# Altium schematic sheet 5_GPIOBanks.SchDoc: GPIO Banks (13-16)
size Legal; Date: 12/27/2025; Author: Praveen Perera; DrawnBy: Praveen Perera; Engineer: Praveen Perera; Revision: 0; SheetNumber: 5; SheetTotal: 9
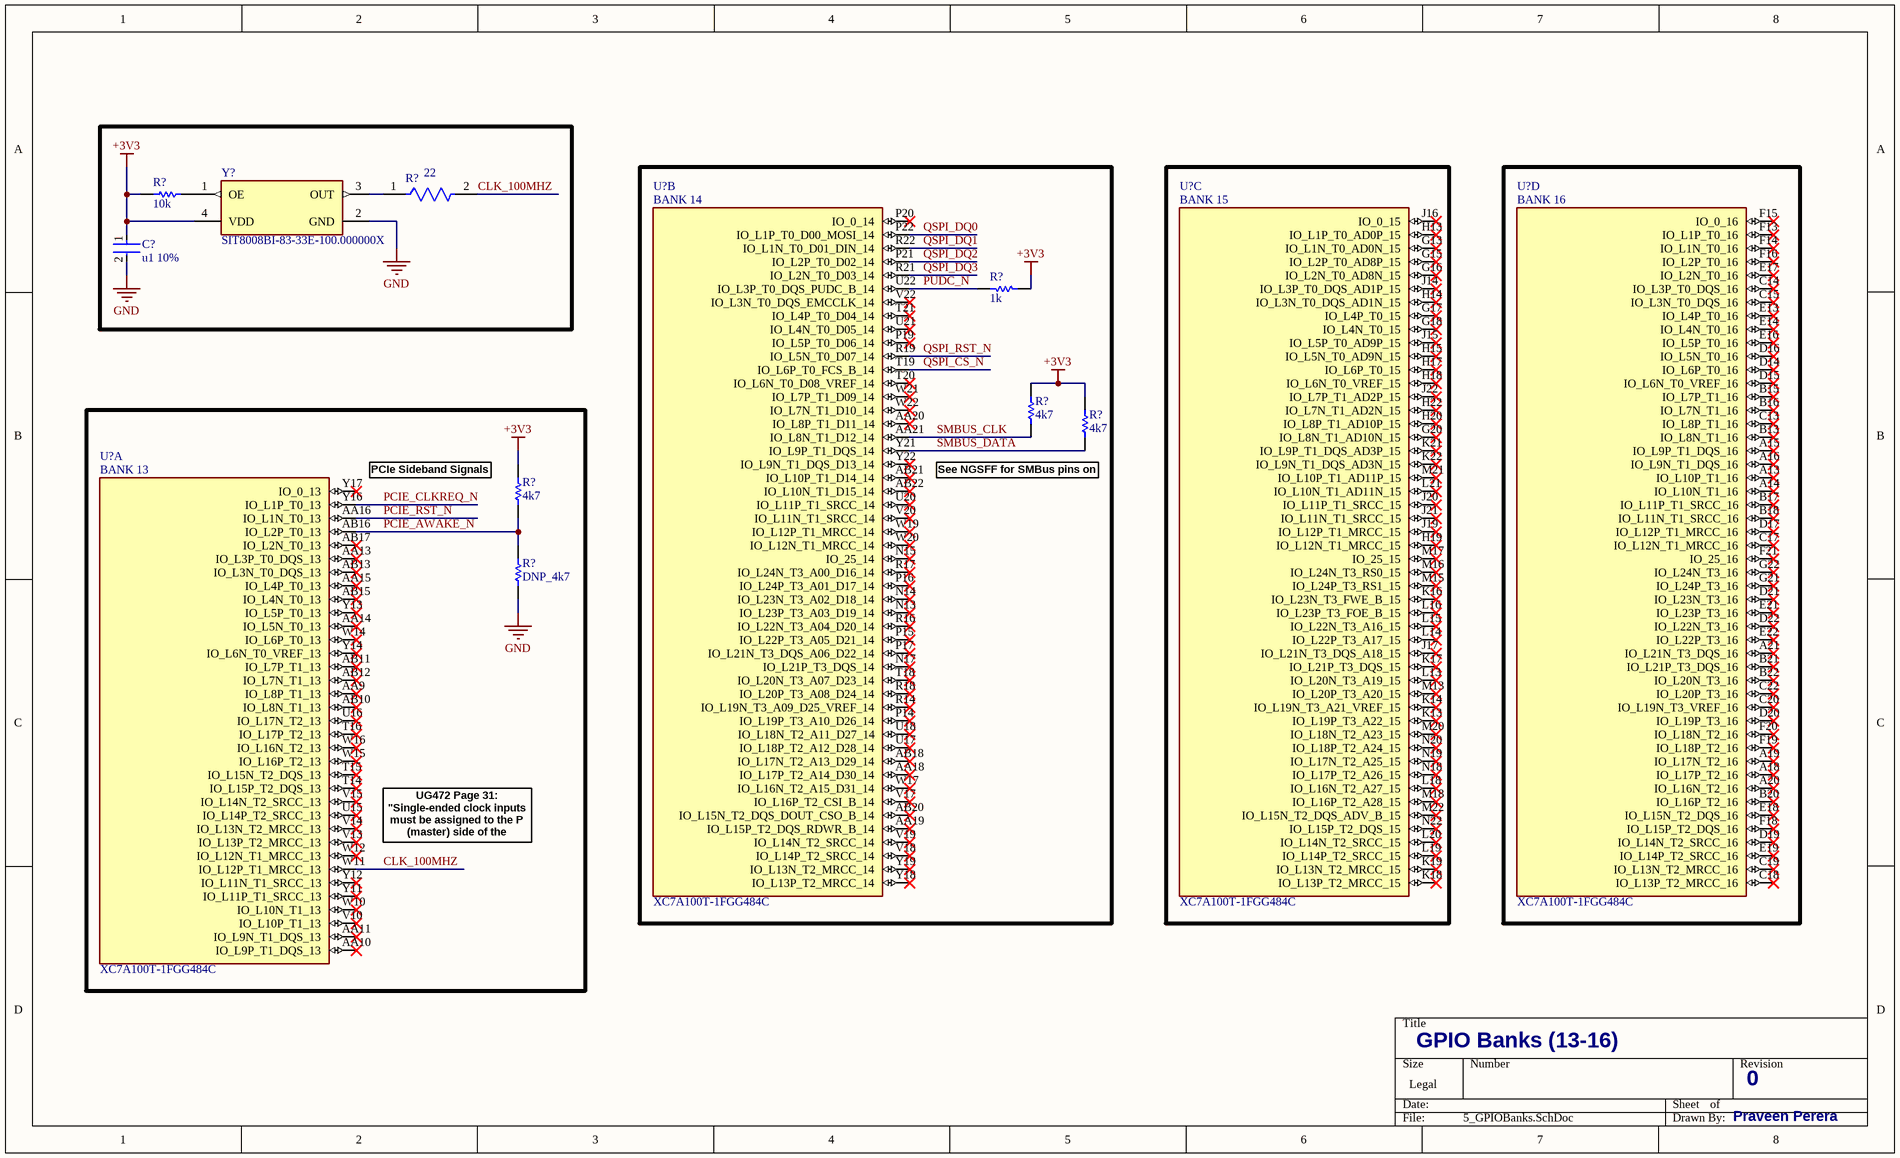
[diagram p0: 5_GPIOBanks.SchDoc]

## Parts
(Parts that share a designator on the sheet are numbered #1, #2 ... from top to bottom, then left to right.)
C?  u1 10%  [FP-CL891-IPC_C]
R?#1  10k  [RESC1005X40X25LL10T10]
R?#2  22  [FP-RMCF0201-IPC_C]
R?#3  1k  [RESC0603X28X15ML05T05]
R?#4  4k7  [RESC0603X28X15NL05T05]
R?#5  4k7  [RESC0603X28X15NL05T05]
R?#6  4k7  [RESC0603X28X15NL05T05]
R?#7  DNP_4k7  [RESC0603X28X15NL05T05]
U?#1  XC7A100T-1FGG484C  [BGA484C100P22X22_2300X2300X260N]  (part B of 14)
U?#2  XC7A100T-1FGG484C  [BGA484C100P22X22_2300X2300X260N]  (part C of 14)
U?#3  XC7A100T-1FGG484C  [BGA484C100P22X22_2300X2300X260N]  (part D of 14)
U?#4  XC7A100T-1FGG484C  [BGA484C100P22X22_2300X2300X260N]  (part A of 14)
Y?  SIT8008BI-83-33E-100.000000X  [FP-SiT8008-8-MFG]

## Nets
+3V3: C?.1 R?#1.1 R?#3.1 R?#4.2 R?#5.2 R?#6.2 Y?.4(VDD)
GND: C?.2 R?#7.1 Y?.2(GND)
CLK_100MHZ: R?#2.2 U?#4.W11(IO_L12P_T1_MRCC_13)
PCIE_AWAKE_N: R?#6.1 R?#7.2 U?#4.AB16(IO_L2P_T0_13)
PCIE_CLKREQ_N: U?#4.Y16(IO_L1P_T0_13)
PCIE_RST_N: U?#4.AA16(IO_L1N_T0_13)
PUDC_N: R?#3.2 U?#1.U22(IO_L3P_T0_DQS_PUDC_B_14)
QSPI_CS_N: U?#1.T19(IO_L6P_T0_FCS_B_14)
QSPI_DQ0: U?#1.P22(IO_L1P_T0_D00_MOSI_14)
QSPI_DQ1: U?#1.R22(IO_L1N_T0_D01_DIN_14)
QSPI_DQ2: U?#1.P21(IO_L2P_T0_D02_14)
QSPI_DQ3: U?#1.R21(IO_L2N_T0_D03_14)
QSPI_RST_N: U?#1.R19(IO_L5N_T0_D07_14)
SMBUS_CLK: R?#4.1 U?#1.AA21(IO_L8N_T1_D12_14)
SMBUS_DATA: R?#5.1 U?#1.Y21(IO_L9P_T1_DQS_14)
NetR?#1_2: R?#1.2 Y?.1(OE)
NetR?#2_1: R?#2.1 Y?.3(OUT)

Not connected (* = marked no-connect by the designer): U?#1 AA18(IO_L17P_T2_A14_D30_14)* AA19(IO_L15P_T2_DQS_RDWR_B_14)* AA20(IO_L8P_T1_D11_14)* AB18(IO_L17N_T2_A13_D29_14)* AB20(IO_L15N_T2_DQS_DOUT_CSO_B_14)* AB21(IO_L10P_T1_D14_14)* AB22(IO_L10N_T1_D15_14)* N13(IO_L23P_T3_A03_D19_14)* N14(IO_L23N_T3_A02_D18_14)* N15(IO_25_14)* N17(IO_L21P_T3_DQS_14)* P14(IO_L19P_T3_A10_D26_14)* P15(IO_L22P_T3_A05_D21_14)* P16(IO_L24P_T3_A01_D17_14)* P17(IO_L21N_T3_DQS_A06_D22_14)* P19(IO_L5P_T0_D06_14)* P20(IO_0_14)* R14(IO_L19N_T3_A09_D25_VREF_14)* R16(IO_L22N_T3_A04_D20_14)* R17(IO_L24N_T3_A00_D16_14)* R18(IO_L20P_T3_A08_D24_14)* T18(IO_L20N_T3_A07_D23_14)* T20(IO_L6N_T0_D08_VREF_14)* T21(IO_L4P_T0_D04_14)* U17(IO_L18P_T2_A12_D28_14)* U18(IO_L18N_T2_A11_D27_14)* U20(IO_L11P_T1_SRCC_14)* U21(IO_L4N_T0_D05_14)* V17(IO_L16P_T2_CSI_B_14)* V18(IO_L14P_T2_SRCC_14)* V19(IO_L14N_T2_SRCC_14)* V20(IO_L11N_T1_SRCC_14)* V22(IO_L3N_T0_DQS_EMCCLK_14)* W17(IO_L16N_T2_A15_D31_14)* W19(IO_L12P_T1_MRCC_14)* W20(IO_L12N_T1_MRCC_14)* W21(IO_L7P_T1_D09_14)* W22(IO_L7N_T1_D10_14)* Y18(IO_L13P_T2_MRCC_14)* Y19(IO_L13N_T2_MRCC_14)* Y22(IO_L9N_T1_DQS_D13_14)*; U?#2 G13(IO_L1N_T0_AD0N_15)* G15(IO_L2P_T0_AD8P_15)* G16(IO_L2N_T0_AD8N_15)* G17(IO_L4P_T0_15)* G18(IO_L4N_T0_15)* G20(IO_L8N_T1_AD10N_15)* H13(IO_L1P_T0_AD0P_15)* H14(IO_L3N_T0_DQS_AD1N_15)* H15(IO_L5N_T0_AD9N_15)* H17(IO_L6P_T0_15)* H18(IO_L6N_T0_VREF_15)* H19(IO_L12N_T1_MRCC_15)* H20(IO_L8P_T1_AD10P_15)* H22(IO_L7N_T1_AD2N_15)* J14(IO_L3P_T0_DQS_AD1P_15)* J15(IO_L5P_T0_AD9P_15)* J16(IO_0_15)* J17(IO_L21N_T3_DQS_A18_15)* J19(IO_L12P_T1_MRCC_15)* J20(IO_L11P_T1_SRCC_15)* J21(IO_L11N_T1_SRCC_15)* J22(IO_L7P_T1_AD2P_15)* K13(IO_L19P_T3_A22_15)* K14(IO_L19N_T3_A21_VREF_15)* K16(IO_L23N_T3_FWE_B_15)* K17(IO_L21P_T3_DQS_15)* K18(IO_L13P_T2_MRCC_15)* K19(IO_L13N_T2_MRCC_15)* K21(IO_L9P_T1_DQS_AD3P_15)* K22(IO_L9N_T1_DQS_AD3N_15)* L13(IO_L20N_T3_A19_15)* L14(IO_L22P_T3_A17_15)* L15(IO_L22N_T3_A16_15)* L16(IO_L23P_T3_FOE_B_15)* L18(IO_L16N_T2_A27_15)* L19(IO_L14P_T2_SRCC_15)* L20(IO_L14N_T2_SRCC_15)* L21(IO_L10N_T1_AD11N_15)* M13(IO_L20P_T3_A20_15)* M15(IO_L24P_T3_RS1_15)* M16(IO_L24N_T3_RS0_15)* M17(IO_25_15)* M18(IO_L16P_T2_A28_15)* M20(IO_L18N_T2_A23_15)* M21(IO_L10P_T1_AD11P_15)* M22(IO_L15N_T2_DQS_ADV_B_15)* N18(IO_L17P_T2_A26_15)* N19(IO_L17N_T2_A25_15)* N20(IO_L18P_T2_A24_15)* N22(IO_L15P_T2_DQS_15)*; U?#3 A13(IO_L10P_T1_16)* A14(IO_L10N_T1_16)* A15(IO_L9P_T1_DQS_16)* A16(IO_L9N_T1_DQS_16)* A18(IO_L17P_T2_16)* A19(IO_L17N_T2_16)* A20(IO_L16N_T2_16)* A21(IO_L21N_T3_DQS_16)* B13(IO_L8N_T1_16)* B15(IO_L7P_T1_16)* B16(IO_L7N_T1_16)* B17(IO_L11P_T1_SRCC_16)* B18(IO_L11N_T1_SRCC_16)* B20(IO_L16P_T2_16)* B21(IO_L21P_T3_DQS_16)* B22(IO_L20N_T3_16)* C13(IO_L8P_T1_16)* C14(IO_L3P_T0_DQS_16)* C15(IO_L3N_T0_DQS_16)* C17(IO_L12N_T1_MRCC_16)* C18(IO_L13P_T2_MRCC_16)* C19(IO_L13N_T2_MRCC_16)* C20(IO_L19N_T3_VREF_16)* C22(IO_L20P_T3_16)* D14(IO_L6P_T0_16)* D15(IO_L6N_T0_VREF_16)* D16(IO_L5N_T0_16)* D17(IO_L12P_T1_MRCC_16)* D19(IO_L14N_T2_SRCC_16)* D20(IO_L19P_T3_16)* D21(IO_L23N_T3_16)* D22(IO_L22N_T3_16)* E13(IO_L4P_T0_16)* E14(IO_L4N_T0_16)* E16(IO_L5P_T0_16)* E17(IO_L2N_T0_16)* E18(IO_L15N_T2_DQS_16)* E19(IO_L14P_T2_SRCC_16)* E21(IO_L23P_T3_16)* E22(IO_L22P_T3_16)* F13(IO_L1P_T0_16)* F14(IO_L1N_T0_16)* F15(IO_0_16)* F16(IO_L2P_T0_16)* F18(IO_L15P_T2_DQS_16)* F19(IO_L18P_T2_16)* F20(IO_L18N_T2_16)* F21(IO_25_16)* G21(IO_L24P_T3_16)* G22(IO_L24N_T3_16)*; U?#4 AA9(IO_L8P_T1_13)* AA10(IO_L9P_T1_DQS_13)* AA11(IO_L9N_T1_DQS_13)* AA13(IO_L3P_T0_DQS_13)* AA14(IO_L5N_T0_13)* AA15(IO_L4P_T0_13)* AB10(IO_L8N_T1_13)* AB11(IO_L7P_T1_13)* AB12(IO_L7N_T1_13)* AB13(IO_L3N_T0_DQS_13)* AB15(IO_L4N_T0_13)* AB17(IO_L2N_T0_13)* T14(IO_L15P_T2_DQS_13)* T15(IO_L15N_T2_DQS_13)* T16(IO_L17P_T2_13)* U15(IO_L14P_T2_SRCC_13)* U16(IO_L17N_T2_13)* V10(IO_L10P_T1_13)* V13(IO_L13P_T2_MRCC_13)* V14(IO_L13N_T2_MRCC_13)* V15(IO_L14N_T2_SRCC_13)* W10(IO_L10N_T1_13)* W12(IO_L12N_T1_MRCC_13)* W14(IO_L6P_T0_13)* W15(IO_L16P_T2_13)* W16(IO_L16N_T2_13)* Y11(IO_L11P_T1_SRCC_13)* Y12(IO_L11N_T1_SRCC_13)* Y13(IO_L5P_T0_13)* Y14(IO_L6N_T0_VREF_13)* Y17(IO_0_13)*

## Notes on the sheet
- PCIe Sideband Signals
- (near R?#5) See NGSFF for SMBus pins on M.2
- UG472 Page 31: "Single-ended clock inputs must be assigned to the P (master) side of the clock-capable
  input pin pair."
- (in symbol XC7A100T-1FGG484C, part A) BANK 13
- (in symbol XC7A100T-1FGG484C, part B) BANK 14
- (in symbol XC7A100T-1FGG484C, part C) BANK 15
- (in symbol XC7A100T-1FGG484C, part D) BANK 16

## Library data of the parts
C? = CMP-13271-001945-1: CL05B104KB5NNNC / Cap Ceramic 100nF 50V X7R ±10% SMD 0402 +125°C Paper T/R
R?#1 = CMP-2002-04584-1: SG73P1ETTP1002F; Manufacturer: KOA Speer; Part Number: SG73P1ETTP1002F
R?#2 = CMP-26527-003623-1: RMCF0201JG22R0 / 22Ω ±5% 0.05W 0201 Thick Film Chip Resistor AEC-Q200 compliant; Max Power Dissipation: 50mW; Resistance: 22R; Temperature Coefficient: 200ppm/°C; Length: 0.024inch; Height: 0.009inch; Max Operating Temperature: 125°C; Packaging: Tape and Reel; Number of Terminations: 2; Case/Package: 0201; Resistor Type: Thick Film; Width: 0.012inch; Case Code (Metric): 0603; Min Operating Temperature: -55°C; Case Code (Imperial): 0201; Tolerance: 5%
R?#3 = CMP-1010-00074-2: CRCW02011K00JNED; Manufacturer: Vishay Dale; Part Number: CRCW02011K00JNED
R?#4-R?#7 = CMP-2004-00672-1: CRCW02014K70FNED; Manufacturer: Vishay Dale; Part Number: CRCW02014K70FNED
U?#1-U?#4 = XC7A100T-1FGG484C: Artix-7 Field Programmable Gate Array (FPGA) IC 285 4976640 101440 484-BBGA; MF: Xilinx Inc.; Value: *; Check_prices: https://www.snapeda.com/parts/XC7A100T-1FGG484C/Xilinx/view-part/?ref=eda; MP: XC7A100T-1FGG484C; SnapEDA_Link: https://www.snapeda.com/parts/XC7A100T-1FGG484C/Xilinx/view-part/?ref=snap; Package: FBGA-484 Xilinx
Y? = CMP-00000-2: Oscillator MEMS 100MHz ±50ppm (Stability) 15pF HCMOS/LVCMOS 55% 3.3V Medical 4-Pin QFN SMD T/R; Max Supply Voltage: 3.63V; Nominal Supply Current: 3.8mA; Max Junction Temperature (Tj): 150°C; Fall Time: 2ns; Low Level Output Current: 4mA; Max Supply Current: 4.5mA; Min Supply Voltage: 2.97V; Min Operating Temperature: -40°C; Width: 5.0038mm; Operating Supply Voltage: 3.3V; Length: 7.0104mm; Height: 1.05mm; Lifecycle Status: Production; Max Operating Temperature: 85°C; Number of Terminals: 4; REACH SVHC: Yes; Rise Time: 2ns; Load Capacitance: 15pF; Mounting Technology: Surface Mount; Case/Package: SMD/SMT; RoHS: Compliant; Frequency Stability: 50ppm; Frequency: 100MHz